# EAGLE design interconnect (EAGLE 9.4.0)
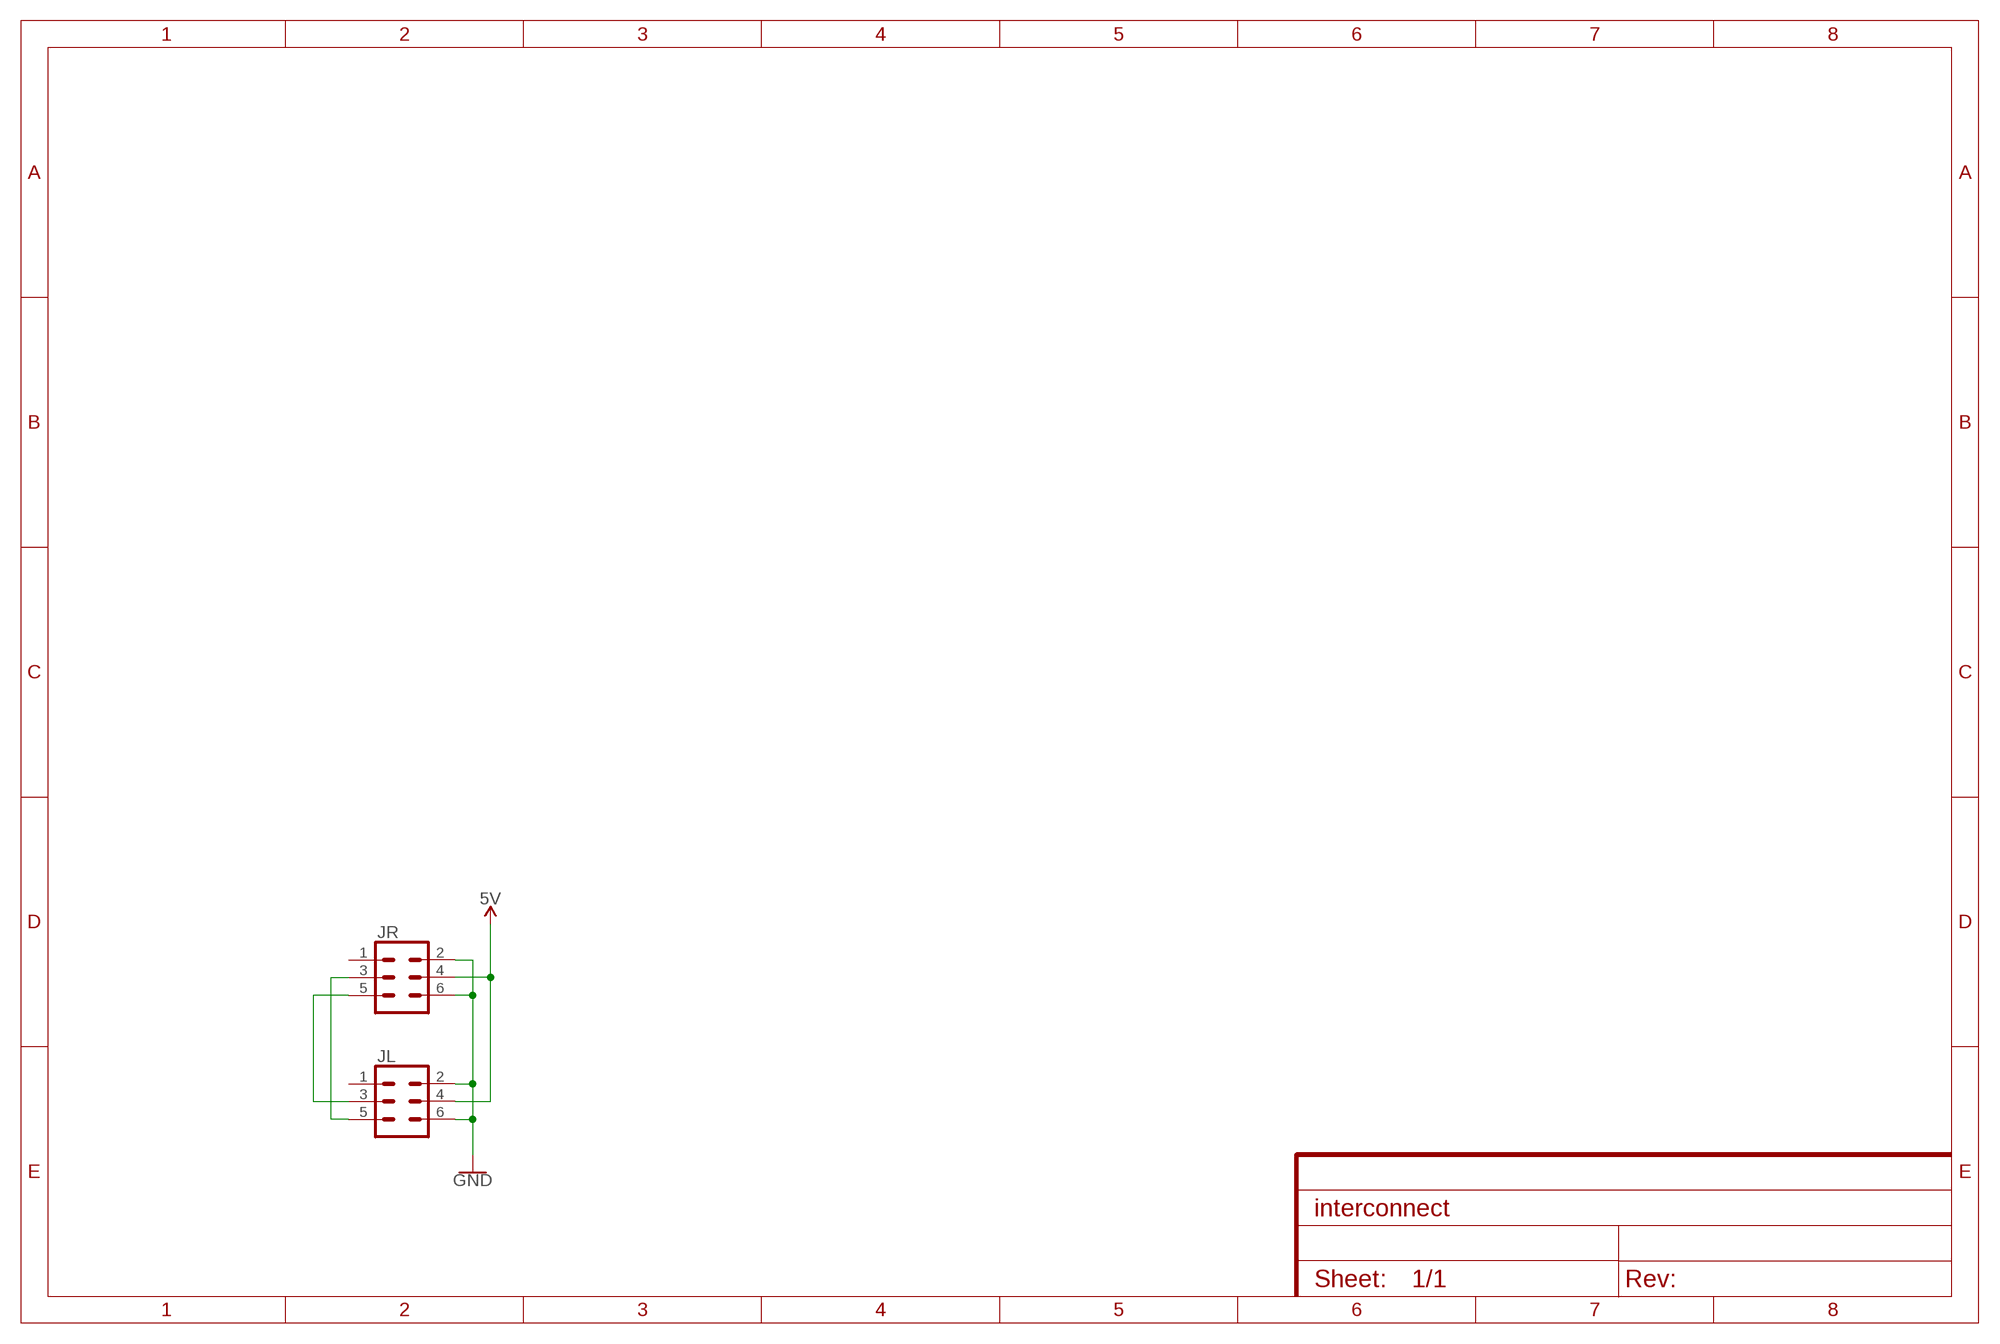
[diagram p0: schematic, sheet 1]

## Parts
JL  CONN_03X2SHROUD  [2X3-SHROUDED]
JR  CONN_03X2SHROUD  [2X3-SHROUDED]

## Nets
5V: JL.4 JR.4
GND: JL.2 JL.6 JR.2 JR.6
N$3: JL.3 JR.5
N$4: JL.5 JR.3
Unconnected: JL.1 JR.1

## Library data of the parts
JL JR = SparkFun-Connectors:CONN_03X2: Multi connection point. Often used as Generic Header-pin footprint for 0.1 inch spaced/style header connections You can populate with any combo of single row headers, but if you'd like an exact match, check these: Header - 2x3 (Male, 0.1") <https://www.sparkfun.com/products/12807> (PRT-12807) Header - 2x3 (Female, 0.1") <https://www.sparkfun.com/products/13010> (PRT-13010) 2x3 Pin Shrouded Header <https://www.sparkfun.com/products/10877> (PRT-10877) On any of the 0.1 inch spaced packages, you can populate with these: Break Away Headers - Straight <https://www.sparkfun.com/products/116> (PRT-00116) Break Away Male Headers - Right Angle <https://www.sparkfun.com/products/553> (PRT-00553) Female Headers <https://www.sparkfun.com/products/115> (PRT-00115) Break Away Headers - Machine Pin <https://www.sparkfun.com/products/117> (PRT-00117) Break Away Female Headers - Swiss Machine Pin <https://www.sparkfun.com/products/743> (PRT-00743) Special note: the shrouded connector mates well with our 3x2 ribbon cables: Ribbon Crimp Connector - 6-pin (2x3, Female) <https://www.sparkfun.com/products/10651> (PRT-10651) Ribbon Cable - 6 wire (15ft) <https://www.sparkfun.com/products/10646> (PRT-10646); PROD_ID: CONN-10681; SF_ID: PRT_10877

## Board
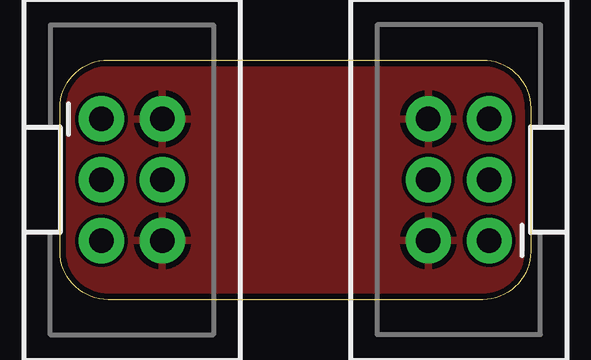
[diagram p1: board, top side]
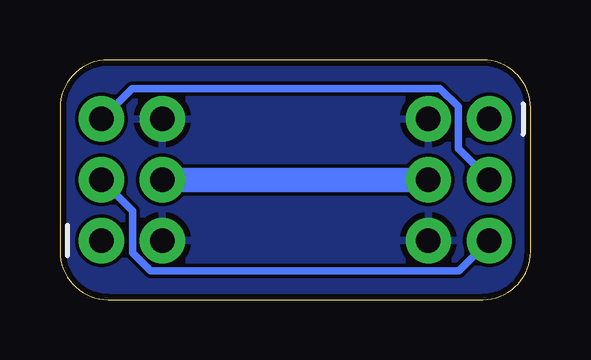
[diagram p2: board, bottom side, seen from below]

Size 19.63 x 10 mm. Coordinates in mm from the lower left corner, seen from the top.
Outline: 19.63,8 19.63,2 arc-90 17.63,0 2,0 arc-90 0,2 0,8 arc-90 2,10 17.63,10 arc-90 19.63,8
Copper layers (1*16): Top 0.035mm / dielectric 1.5mm / Bottom 0.035mm
Design rules "dirtypcbs": minimum track width 6mil, minimum drill 12mil, track to track 6mil, track to pad 6mil, pad to pad 6mil, via to via 6mil, smd to smd 0mil, copper to edge 10mil, drill to drill 10mil, minimum pad ring 10mil, minimum via ring 6mil, stop-mask expansion 2mil, vias tented up to drill 25mil, thermal gap 10mil

### Footprints (pad centres in the part's own frame; a part is rotated, then mirrored left to right if it is on the bottom)
2X3-SHROUDED = drill 1.016 pad 1.88: 1 -1.27,2.54; 2 1.27,2.54; 3 -1.27,0; 4 1.27,0; 5 -1.27,-2.54; 6 1.27,-2.54

### Placement (x,y rotation side)
JL  3,5 0 top
JR  16.63,5 180 top

### Tracks (layer width: path | path; a pad name or v marks a point on that pad's centre or on a via)
5V
  Bottom 1.016: JL.4 JR.4
GND
  pour Bottom: -0.34,11.35 21.25,11.35 21.25,-1.35 -1.61,-1.35 -1.61,11.35
  pour Top: -2.88,12.62 22.52,12.62 22.52,-2.62 -2.88,-2.62
N$3
  Bottom 0.305: JR.5 16.63,8.81 3.78,8.81 3.03,8.06 3.03,6.29 JL.3
N$4
  Bottom 0.305: JL.5 3,1.19 15.85,1.19 16.61,1.94 16.61,3.71 JR.3